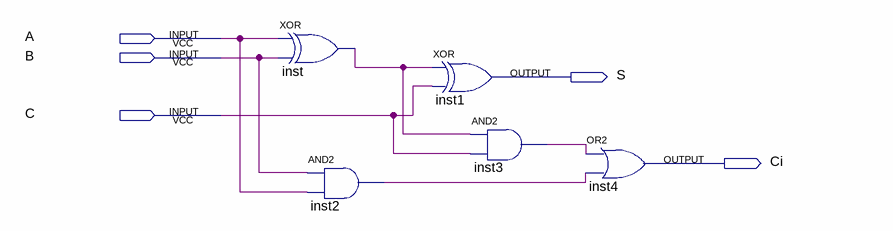
[diagram p0: schematic sheet]
// Quartus schematic ryu_FA.bdf as structural Verilog: 5 symbols, 5 pins
module ryu_FA (
  input  A,
  input  B,
  input  C,
  output S,
  output Ci
);

  wire inst2_out, inst3_out, inst_out;

  xor inst (inst_out, A, B);
  and inst2 (inst2_out, B, A);
  xor inst1 (S, inst_out, C);
  and inst3 (inst3_out, inst_out, C);
  or inst4 (Ci, inst3_out, inst2_out);
endmodule
